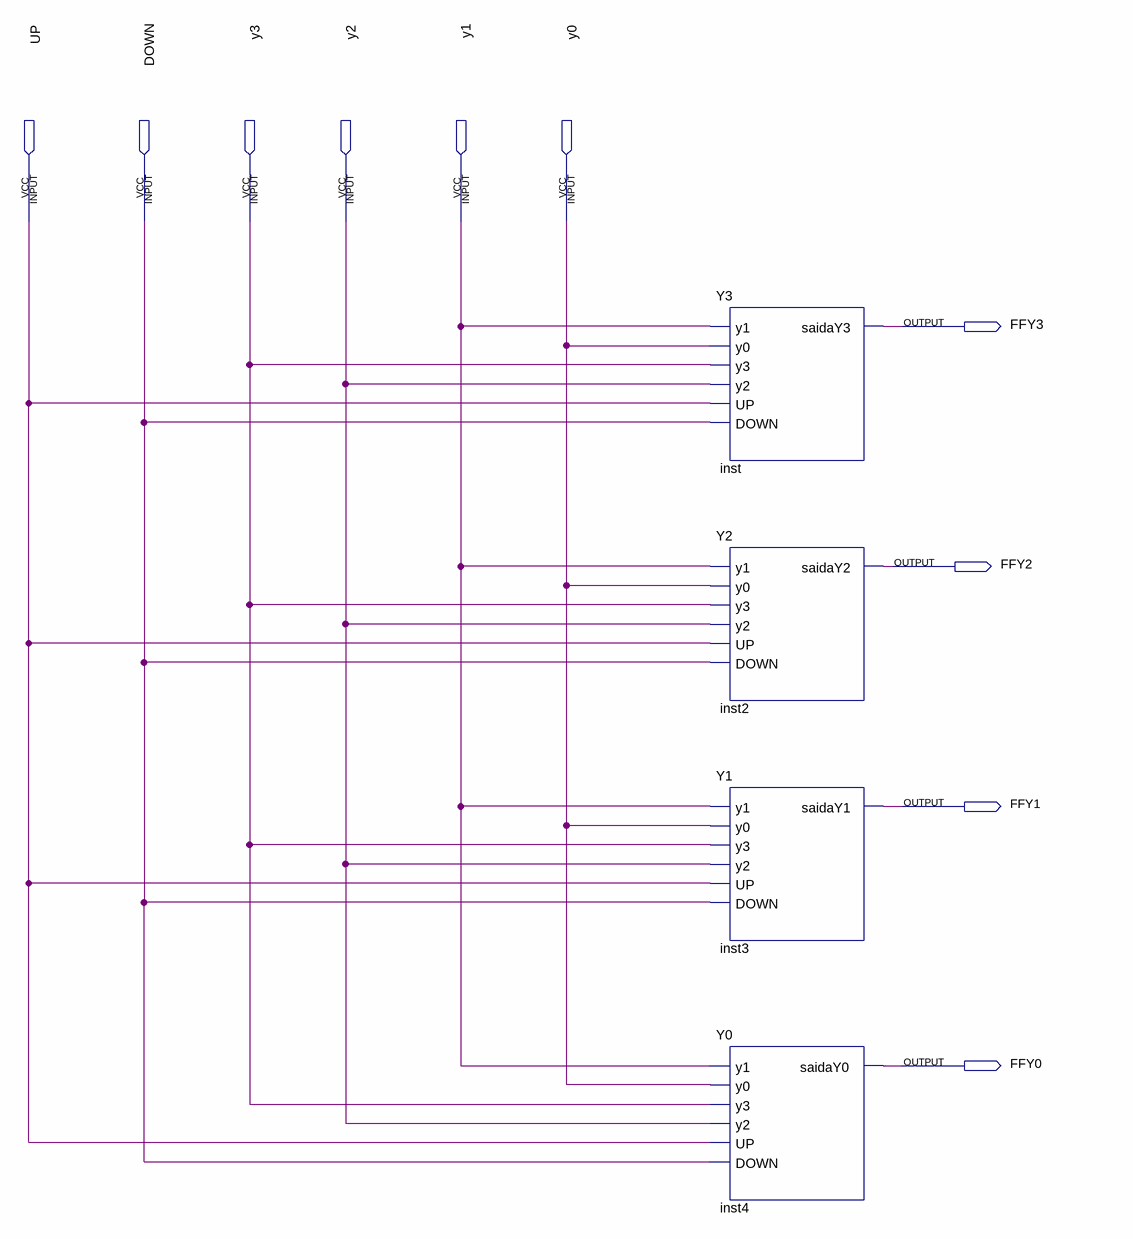
[diagram p0: schematic sheet]
// Quartus schematic CircuitoEntrada.bdf as structural Verilog: 4 symbols, 10 pins
module CircuitoEntrada (
  input  UP,
  input  DOWN,
  input  y3,
  input  y2,
  input  y1,
  input  y0,
  output FFY3,
  output FFY2,
  output FFY1,
  output FFY0
);

  Y3 inst (.y1(y1), .y0(y0), .y3(y3), .y2(y2), .UP(UP), .DOWN(DOWN), .saidaY3(FFY3));
  Y2 inst2 (.y1(y1), .y0(y0), .y3(y3), .y2(y2), .UP(UP), .DOWN(DOWN), .saidaY2(FFY2));
  Y1 inst3 (.y1(y1), .y0(y0), .y3(y3), .y2(y2), .UP(UP), .DOWN(DOWN), .saidaY1(FFY1));
  Y0 inst4 (.y1(y1), .y0(y0), .y3(y3), .y2(y2), .UP(UP), .DOWN(DOWN), .saidaY0(FFY0));
endmodule
